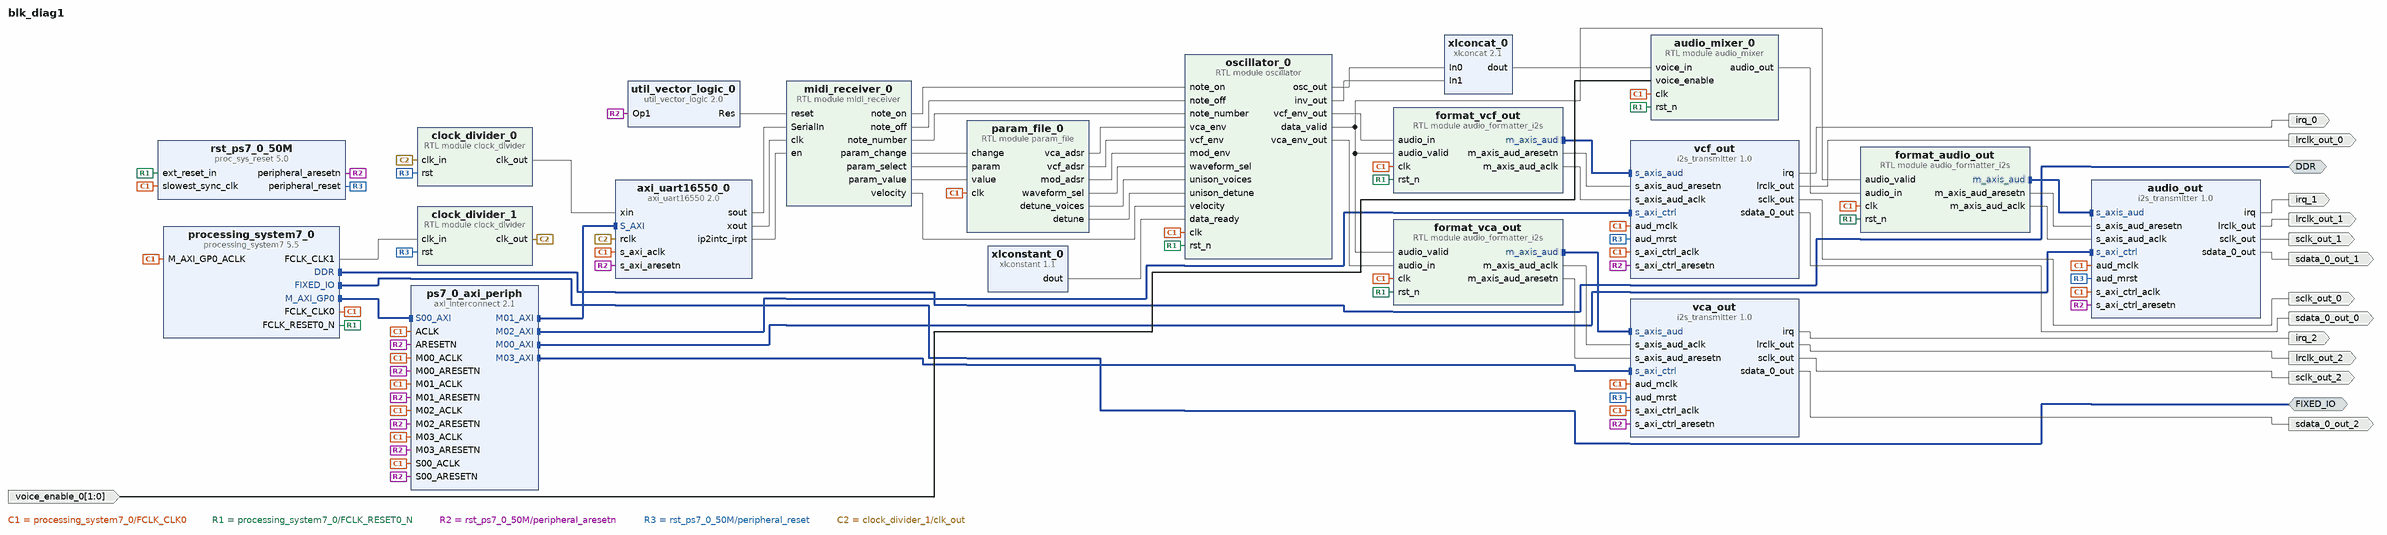
[diagram p0: block diagram of the top level]
# Vivado block design blk_diag1, xc7z020clg400-1, Vivado 2018.3
create_bd_design blk_diag1

create_bd_intf_port -mode Master -vlnv xilinx.com:interface:ddrx_rtl:1.0 DDR
create_bd_intf_port -mode Master -vlnv xilinx.com:display_processing_system7:fixedio_rtl:1.0 FIXED_IO
create_bd_port -dir I -from 1 -to 0 voice_enable_0
create_bd_port -dir O -type intr irq_0
create_bd_port -dir O lrclk_out_0
create_bd_port -dir O sclk_out_0
create_bd_port -dir O sdata_0_out_0
create_bd_port -dir O sdata_0_out_1
create_bd_port -dir O sclk_out_1
create_bd_port -dir O lrclk_out_1
create_bd_port -dir O -type intr irq_1
create_bd_port -dir O -type intr irq_2
create_bd_port -dir O lrclk_out_2
create_bd_port -dir O sclk_out_2
create_bd_port -dir O sdata_0_out_2

create_bd_cell -type module -reference audio_mixer audio_mixer_0
set_property -dict {CONFIG.VOICE_COUNT 2} [get_bd_cells audio_mixer_0]
create_bd_cell -type ip -vlnv xilinx.com:ip:i2s_transmitter:1.0 audio_out
create_bd_cell -type module -reference audio_formatter_i2s format_audio_out
set_property -dict {CONFIG.NUM_CHANNELS 1} [get_bd_cells format_audio_out]
create_bd_cell -type ip -vlnv xilinx.com:ip:axi_interconnect:2.1 ps7_0_axi_periph
set_property -dict {CONFIG.NUM_MI 4} [get_bd_cells ps7_0_axi_periph]
create_bd_cell -type ip -vlnv xilinx.com:ip:xlconcat:2.1 xlconcat_0
set_property -dict {CONFIG.IN0_WIDTH 24 CONFIG.IN1_WIDTH 24} [get_bd_cells xlconcat_0]
create_bd_cell -type ip -vlnv xilinx.com:ip:processing_system7:5.5 processing_system7_0
set_property -dict [list \
  CONFIG.PCW_APU_PERIPHERAL_FREQMHZ 666.666666 \
  CONFIG.PCW_ENET0_ENET0_IO {MIO 16 .. 27} \
  CONFIG.PCW_ENET0_GRP_MDIO_ENABLE 1 \
  CONFIG.PCW_ENET0_GRP_MDIO_IO {MIO 52 .. 53} \
  CONFIG.PCW_ENET0_PERIPHERAL_CLKSRC {ARM PLL} \
  CONFIG.PCW_ENET0_PERIPHERAL_ENABLE 1 \
  CONFIG.PCW_ENET0_RESET_ENABLE 0 \
  CONFIG.PCW_ENET_RESET_ENABLE 1 \
  CONFIG.PCW_ENET_RESET_SELECT {Share reset pin} \
  CONFIG.PCW_EN_CLK1_PORT 1 \
  CONFIG.PCW_FCLK_CLK1_BUF TRUE \
  CONFIG.PCW_FPGA0_PERIPHERAL_FREQMHZ 100 \
  CONFIG.PCW_FPGA1_PERIPHERAL_FREQMHZ 1 \
  CONFIG.PCW_FPGA_FCLK1_ENABLE 1 \
  CONFIG.PCW_GPIO_EMIO_GPIO_ENABLE 1 \
  CONFIG.PCW_GPIO_EMIO_GPIO_IO 64 \
  CONFIG.PCW_GPIO_MIO_GPIO_ENABLE 1 \
  CONFIG.PCW_GPIO_MIO_GPIO_IO MIO \
  CONFIG.PCW_GPIO_PERIPHERAL_ENABLE 1 \
  CONFIG.PCW_I2C_RESET_ENABLE 0 \
  CONFIG.PCW_PERIPHERAL_BOARD_PRESET part0 \
  CONFIG.PCW_PRESET_BANK1_VOLTAGE {LVCMOS 1.8V} \
  CONFIG.PCW_QSPI_GRP_FBCLK_ENABLE 1 \
  CONFIG.PCW_QSPI_GRP_FBCLK_IO {MIO 8} \
  CONFIG.PCW_QSPI_GRP_SINGLE_SS_ENABLE 1 \
  CONFIG.PCW_QSPI_GRP_SINGLE_SS_IO {MIO 1 .. 6} \
  CONFIG.PCW_QSPI_PERIPHERAL_ENABLE 1 \
  CONFIG.PCW_QSPI_QSPI_IO {MIO 1 .. 6} \
  CONFIG.PCW_SD0_GRP_CD_ENABLE 1 \
  CONFIG.PCW_SD0_GRP_CD_IO {MIO 46} \
  CONFIG.PCW_SD0_GRP_WP_ENABLE 1 \
  CONFIG.PCW_SD0_GRP_WP_IO {MIO 47} \
  CONFIG.PCW_SD0_PERIPHERAL_ENABLE 1 \
  CONFIG.PCW_SD0_SD0_IO {MIO 40 .. 45} \
  CONFIG.PCW_SDIO_PERIPHERAL_FREQMHZ 100 \
  CONFIG.PCW_SINGLE_QSPI_DATA_MODE x4 \
  CONFIG.PCW_TTC0_PERIPHERAL_ENABLE 1 \
  CONFIG.PCW_TTC0_TTC0_IO EMIO \
  CONFIG.PCW_UART0_PERIPHERAL_ENABLE 1 \
  CONFIG.PCW_UART0_UART0_IO {MIO 10 .. 11} \
  CONFIG.PCW_UART1_PERIPHERAL_ENABLE 1 \
  CONFIG.PCW_UART1_UART1_IO {MIO 48 .. 49} \
  CONFIG.PCW_UART_PERIPHERAL_FREQMHZ 100 \
  CONFIG.PCW_UIPARAM_DDR_FREQ_MHZ 533.333333 \
  CONFIG.PCW_UIPARAM_DDR_PARTNO {MT41J256M16 RE-125} \
  CONFIG.PCW_USB0_PERIPHERAL_ENABLE 1 \
  CONFIG.PCW_USB0_RESET_ENABLE 1 \
  CONFIG.PCW_USB0_RESET_IO {MIO 51} \
  CONFIG.PCW_USB0_USB0_IO {MIO 28 .. 39} \
  CONFIG.PCW_USB_RESET_ENABLE 1 \
  CONFIG.PCW_USB_RESET_SELECT {Share reset pin} \
] [get_bd_cells processing_system7_0]
# 507 more settings of processing_system7_0 are not shown: defaults, MIO pin electricals, DDR timing, and values the tool derives
create_bd_cell -type ip -vlnv xilinx.com:ip:proc_sys_reset:5.0 rst_ps7_0_50M
create_bd_cell -type module -reference clock_divider clock_divider_0
set_property -dict {CONFIG.DIVISOR 16} [get_bd_cells clock_divider_0]
create_bd_cell -type ip -vlnv xilinx.com:ip:axi_uart16550:2.0 axi_uart16550_0
set_property -dict [list \
  CONFIG.C_EXTERNAL_XIN_CLK_HZ 1000000 \
  CONFIG.C_EXTERNAL_XIN_CLK_HZ_d 1 \
  CONFIG.C_HAS_EXTERNAL_RCLK 1 \
  CONFIG.C_HAS_EXTERNAL_XIN 1 \
  CONFIG.C_IS_A_16550 16550 \
] [get_bd_cells axi_uart16550_0]
create_bd_cell -type module -reference clock_divider clock_divider_1
set_property -dict {CONFIG.DIVISOR 2} [get_bd_cells clock_divider_1]
create_bd_cell -type module -reference midi_receiver midi_receiver_0
create_bd_cell -type module -reference oscillator oscillator_0
create_bd_cell -type module -reference param_file param_file_0
create_bd_cell -type ip -vlnv xilinx.com:ip:xlconstant:1.1 xlconstant_0
create_bd_cell -type ip -vlnv xilinx.com:ip:i2s_transmitter:1.0 vcf_out
create_bd_cell -type ip -vlnv xilinx.com:ip:i2s_transmitter:1.0 vca_out
create_bd_cell -type module -reference audio_formatter_i2s format_vca_out
set_property -dict {CONFIG.NUM_CHANNELS 1} [get_bd_cells format_vca_out]
create_bd_cell -type module -reference audio_formatter_i2s format_vcf_out
set_property -dict {CONFIG.NUM_CHANNELS 1} [get_bd_cells format_vcf_out]
create_bd_cell -type ip -vlnv xilinx.com:ip:util_vector_logic:2.0 util_vector_logic_0
set_property -dict {CONFIG.C_OPERATION not CONFIG.C_SIZE 1} [get_bd_cells util_vector_logic_0]

# ---- connections ----

connect_bd_intf_net -intf_net audio_formatter_i2s_2_m_axis_aud [get_bd_intf_pins format_vcf_out/m_axis_aud] [get_bd_intf_pins vcf_out/s_axis_aud]
connect_bd_intf_net -intf_net audio_formatter_i2s_0_m_axis_aud [get_bd_intf_pins format_audio_out/m_axis_aud] [get_bd_intf_pins audio_out/s_axis_aud]
connect_bd_intf_net [get_bd_intf_pins processing_system7_0/M_AXI_GP0] [get_bd_intf_pins ps7_0_axi_periph/S00_AXI]
connect_bd_intf_net [get_bd_intf_ports DDR] [get_bd_intf_pins processing_system7_0/DDR]
connect_bd_intf_net [get_bd_intf_pins ps7_0_axi_periph/M01_AXI] [get_bd_intf_pins axi_uart16550_0/S_AXI]
connect_bd_intf_net [get_bd_intf_pins ps7_0_axi_periph/M00_AXI] [get_bd_intf_pins audio_out/s_axi_ctrl]
connect_bd_intf_net [get_bd_intf_ports FIXED_IO] [get_bd_intf_pins processing_system7_0/FIXED_IO]
connect_bd_intf_net [get_bd_intf_pins ps7_0_axi_periph/M02_AXI] [get_bd_intf_pins vcf_out/s_axi_ctrl]
connect_bd_intf_net [get_bd_intf_pins ps7_0_axi_periph/M03_AXI] [get_bd_intf_pins vca_out/s_axi_ctrl]
connect_bd_intf_net -intf_net audio_formatter_i2s_1_m_axis_aud [get_bd_intf_pins format_vca_out/m_axis_aud] [get_bd_intf_pins vca_out/s_axis_aud]
connect_bd_net [get_bd_pins midi_receiver_0/note_on] [get_bd_pins oscillator_0/note_on]
connect_bd_net -net audio_formatter_i2s_0_m_axis_aud_aresetn [get_bd_pins format_audio_out/m_axis_aud_aresetn] \
  [get_bd_pins audio_out/s_axis_aud_aresetn]
connect_bd_net -net audio_formatter_i2s_0_m_axis_aud_aclk [get_bd_pins format_audio_out/m_axis_aud_aclk] [get_bd_pins audio_out/s_axis_aud_aclk]
connect_bd_net [get_bd_pins processing_system7_0/FCLK_CLK0] \
  [get_bd_pins ps7_0_axi_periph/S00_ACLK] [get_bd_pins audio_out/s_axi_ctrl_aclk] [get_bd_pins ps7_0_axi_periph/M00_ACLK] \
  [get_bd_pins ps7_0_axi_periph/ACLK] [get_bd_pins audio_out/aud_mclk] [get_bd_pins audio_mixer_0/clk] \
  [get_bd_pins format_audio_out/clk] [get_bd_pins processing_system7_0/M_AXI_GP0_ACLK] \
  [get_bd_pins rst_ps7_0_50M/slowest_sync_clk] [get_bd_pins axi_uart16550_0/s_axi_aclk] \
  [get_bd_pins ps7_0_axi_periph/M01_ACLK] [get_bd_pins oscillator_0/clk] [get_bd_pins param_file_0/clk] \
  [get_bd_pins vcf_out/s_axi_ctrl_aclk] [get_bd_pins ps7_0_axi_periph/M02_ACLK] [get_bd_pins vcf_out/aud_mclk] \
  [get_bd_pins vca_out/s_axi_ctrl_aclk] [get_bd_pins ps7_0_axi_periph/M03_ACLK] [get_bd_pins vca_out/aud_mclk] \
  [get_bd_pins format_vca_out/clk] [get_bd_pins format_vcf_out/clk]
connect_bd_net [get_bd_pins processing_system7_0/FCLK_RESET0_N] \
  [get_bd_pins rst_ps7_0_50M/ext_reset_in] [get_bd_pins format_audio_out/rst_n] [get_bd_pins audio_mixer_0/rst_n] \
  [get_bd_pins oscillator_0/rst_n] [get_bd_pins format_vca_out/rst_n] [get_bd_pins format_vcf_out/rst_n]
connect_bd_net [get_bd_pins rst_ps7_0_50M/peripheral_aresetn] \
  [get_bd_pins ps7_0_axi_periph/S00_ARESETN] [get_bd_pins audio_out/s_axi_ctrl_aresetn] \
  [get_bd_pins ps7_0_axi_periph/M00_ARESETN] [get_bd_pins ps7_0_axi_periph/ARESETN] \
  [get_bd_pins axi_uart16550_0/s_axi_aresetn] [get_bd_pins ps7_0_axi_periph/M01_ARESETN] \
  [get_bd_pins vcf_out/s_axi_ctrl_aresetn] [get_bd_pins ps7_0_axi_periph/M02_ARESETN] \
  [get_bd_pins vca_out/s_axi_ctrl_aresetn] [get_bd_pins ps7_0_axi_periph/M03_ARESETN] [get_bd_pins util_vector_logic_0/Op1]
connect_bd_net [get_bd_pins rst_ps7_0_50M/peripheral_reset] \
  [get_bd_pins audio_out/aud_mrst] [get_bd_pins vcf_out/aud_mrst] [get_bd_pins vca_out/aud_mrst] \
  [get_bd_pins clock_divider_1/rst] [get_bd_pins clock_divider_0/rst]
connect_bd_net [get_bd_pins oscillator_0/osc_out] [get_bd_pins xlconcat_0/In0]
connect_bd_net [get_bd_pins oscillator_0/inv_out] [get_bd_pins xlconcat_0/In1]
connect_bd_net [get_bd_pins xlconcat_0/dout] [get_bd_pins audio_mixer_0/voice_in]
connect_bd_net [get_bd_pins audio_mixer_0/audio_out] [get_bd_pins format_audio_out/audio_in]
connect_bd_net [get_bd_pins oscillator_0/data_valid] \
  [get_bd_pins format_audio_out/audio_valid] [get_bd_pins format_vca_out/audio_valid] \
  [get_bd_pins format_vcf_out/audio_valid]
connect_bd_net -net voice_enable_0_1 [get_bd_ports voice_enable_0] [get_bd_pins audio_mixer_0/voice_enable]
connect_bd_net [get_bd_pins processing_system7_0/FCLK_CLK1] [get_bd_pins clock_divider_1/clk_in]
connect_bd_net [get_bd_pins clock_divider_0/clk_out] [get_bd_pins axi_uart16550_0/xin]
connect_bd_net [get_bd_pins clock_divider_1/clk_out] [get_bd_pins clock_divider_0/clk_in] [get_bd_pins axi_uart16550_0/rclk]
connect_bd_net [get_bd_pins axi_uart16550_0/sout] [get_bd_pins midi_receiver_0/SerialIn]
connect_bd_net [get_bd_pins axi_uart16550_0/xout] [get_bd_pins midi_receiver_0/clk]
connect_bd_net [get_bd_pins midi_receiver_0/note_off] [get_bd_pins oscillator_0/note_off]
connect_bd_net [get_bd_pins midi_receiver_0/note_number] [get_bd_pins oscillator_0/note_number]
connect_bd_net [get_bd_pins midi_receiver_0/velocity] [get_bd_pins oscillator_0/velocity]
connect_bd_net [get_bd_pins axi_uart16550_0/ip2intc_irpt] [get_bd_pins midi_receiver_0/en]
connect_bd_net [get_bd_pins midi_receiver_0/param_change] [get_bd_pins param_file_0/change]
connect_bd_net [get_bd_pins midi_receiver_0/param_select] [get_bd_pins param_file_0/param]
connect_bd_net [get_bd_pins midi_receiver_0/param_value] [get_bd_pins param_file_0/value]
connect_bd_net [get_bd_pins param_file_0/vca_adsr] [get_bd_pins oscillator_0/vca_env]
connect_bd_net [get_bd_pins param_file_0/vcf_adsr] [get_bd_pins oscillator_0/vcf_env]
connect_bd_net [get_bd_pins param_file_0/mod_adsr] [get_bd_pins oscillator_0/mod_env]
connect_bd_net [get_bd_pins param_file_0/waveform_sel] [get_bd_pins oscillator_0/waveform_sel]
connect_bd_net [get_bd_pins param_file_0/detune_voices] [get_bd_pins oscillator_0/unison_voices]
connect_bd_net [get_bd_pins param_file_0/detune] [get_bd_pins oscillator_0/unison_detune]
connect_bd_net [get_bd_pins xlconstant_0/dout] [get_bd_pins oscillator_0/data_ready]
connect_bd_net -net audio_formatter_i2s_2_m_axis_aud_aresetn [get_bd_pins format_vcf_out/m_axis_aud_aresetn] [get_bd_pins vcf_out/s_axis_aud_aresetn]
connect_bd_net -net audio_formatter_i2s_2_m_axis_aud_aclk [get_bd_pins format_vcf_out/m_axis_aud_aclk] [get_bd_pins vcf_out/s_axis_aud_aclk]
connect_bd_net -net audio_formatter_i2s_1_m_axis_aud_aclk [get_bd_pins format_vca_out/m_axis_aud_aclk] [get_bd_pins vca_out/s_axis_aud_aclk]
connect_bd_net -net audio_formatter_i2s_1_m_axis_aud_aresetn [get_bd_pins format_vca_out/m_axis_aud_aresetn] [get_bd_pins vca_out/s_axis_aud_aresetn]
connect_bd_net [get_bd_pins oscillator_0/vca_env_out] [get_bd_pins format_vca_out/audio_in]
connect_bd_net [get_bd_pins oscillator_0/vcf_env_out] [get_bd_pins format_vcf_out/audio_in]
connect_bd_net [get_bd_pins util_vector_logic_0/Res] [get_bd_pins midi_receiver_0/reset]
connect_bd_net -net i2s_transmitter_1_irq [get_bd_pins vcf_out/irq] [get_bd_ports irq_0]
connect_bd_net -net i2s_transmitter_1_lrclk_out [get_bd_pins vcf_out/lrclk_out] [get_bd_ports lrclk_out_0]
connect_bd_net -net i2s_transmitter_1_sclk_out [get_bd_pins vcf_out/sclk_out] [get_bd_ports sclk_out_0]
connect_bd_net -net i2s_transmitter_1_sdata_0_out [get_bd_pins vcf_out/sdata_0_out] [get_bd_ports sdata_0_out_0]
connect_bd_net -net i2s_transmitter_0_sdata_0_out [get_bd_pins audio_out/sdata_0_out] [get_bd_ports sdata_0_out_1]
connect_bd_net -net i2s_transmitter_0_sclk_out [get_bd_pins audio_out/sclk_out] [get_bd_ports sclk_out_1]
connect_bd_net -net i2s_transmitter_0_lrclk_out [get_bd_pins audio_out/lrclk_out] [get_bd_ports lrclk_out_1]
connect_bd_net -net i2s_transmitter_0_irq [get_bd_pins audio_out/irq] [get_bd_ports irq_1]
connect_bd_net -net i2s_transmitter_2_irq [get_bd_pins vca_out/irq] [get_bd_ports irq_2]
connect_bd_net -net i2s_transmitter_2_lrclk_out [get_bd_pins vca_out/lrclk_out] [get_bd_ports lrclk_out_2]
connect_bd_net -net i2s_transmitter_2_sclk_out [get_bd_pins vca_out/sclk_out] [get_bd_ports sclk_out_2]
connect_bd_net -net i2s_transmitter_2_sdata_0_out [get_bd_pins vca_out/sdata_0_out] [get_bd_ports sdata_0_out_2]

# ---- address map ----
assign_bd_address -offset 0x43C00000 -range 64K -target_address_space [get_bd_addr_spaces processing_system7_0/Data] [get_bd_addr_segs audio_out/s_axi_ctrl/Reg]
assign_bd_address -offset 0x43C10000 -range 64K -target_address_space [get_bd_addr_spaces processing_system7_0/Data] [get_bd_addr_segs axi_uart16550_0/S_AXI/Reg]
assign_bd_address -offset 0x43C20000 -range 64K -target_address_space [get_bd_addr_spaces processing_system7_0/Data] [get_bd_addr_segs vcf_out/s_axi_ctrl/Reg]
assign_bd_address -offset 0x43C30000 -range 64K -target_address_space [get_bd_addr_spaces processing_system7_0/Data] [get_bd_addr_segs vca_out/s_axi_ctrl/Reg]

validate_bd_design
save_bd_design
